# EAGLE design mouseaid (EAGLE 7.2.0)
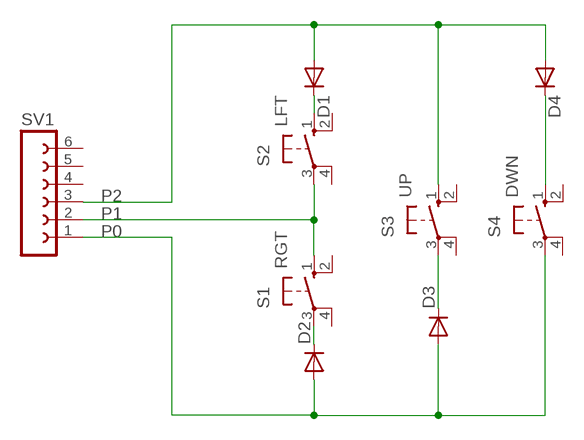
[diagram p0: schematic, sheet 1]

## Parts
D1  DIODE-D-7.5  [D-7.5]
D2  DIODE-D-7.5  [D-7.5]
D3  DIODE-D-7.5  [D-7.5]
D4  DIODE-D-7.5  [D-7.5]
S1  RGT  40-XX  [B3F-40XX]
S2  LFT  40-XX  [B3F-40XX]
S3  UP  40-XX  [B3F-40XX]
S4  DWN  40-XX  [B3F-40XX]
SV1  FE06W  [FE06W]

## Nets
N$1: D4.C S4.1(S)
N$2: D1.C S2.1(S)
N$3: D2.C S1.3(P)
N$4: D3.C S3.3(P)
P0: D2.A D3.A S4.3(P) SV1.1
P1: S1.1(S) S2.3(P) SV1.2
P2: D1.A D4.A S3.1(S) SV1.3
Unconnected: S1.2(S1) S1.4(P1) S2.2(S1) S2.4(P1) S3.2(S1) S3.4(P1) S4.2(S1) S4.4(P1) SV1.4 SV1.5 SV1.6

## Library data of the parts
D1-D4 = diode:DIODE-: DIODE
S1-S4 = switch-omron:40-XX: OMRON SWITCH; MF: OMRON COMPONENTS USA; MPN: B3F-4000; OC_FARNELL: 176434; OC_NEWARK: 36K3105
SV1 = con-lsta:FE06W: FEMALE HEADER; OC_FARNELL: unknown; OC_NEWARK: unknown

## Board
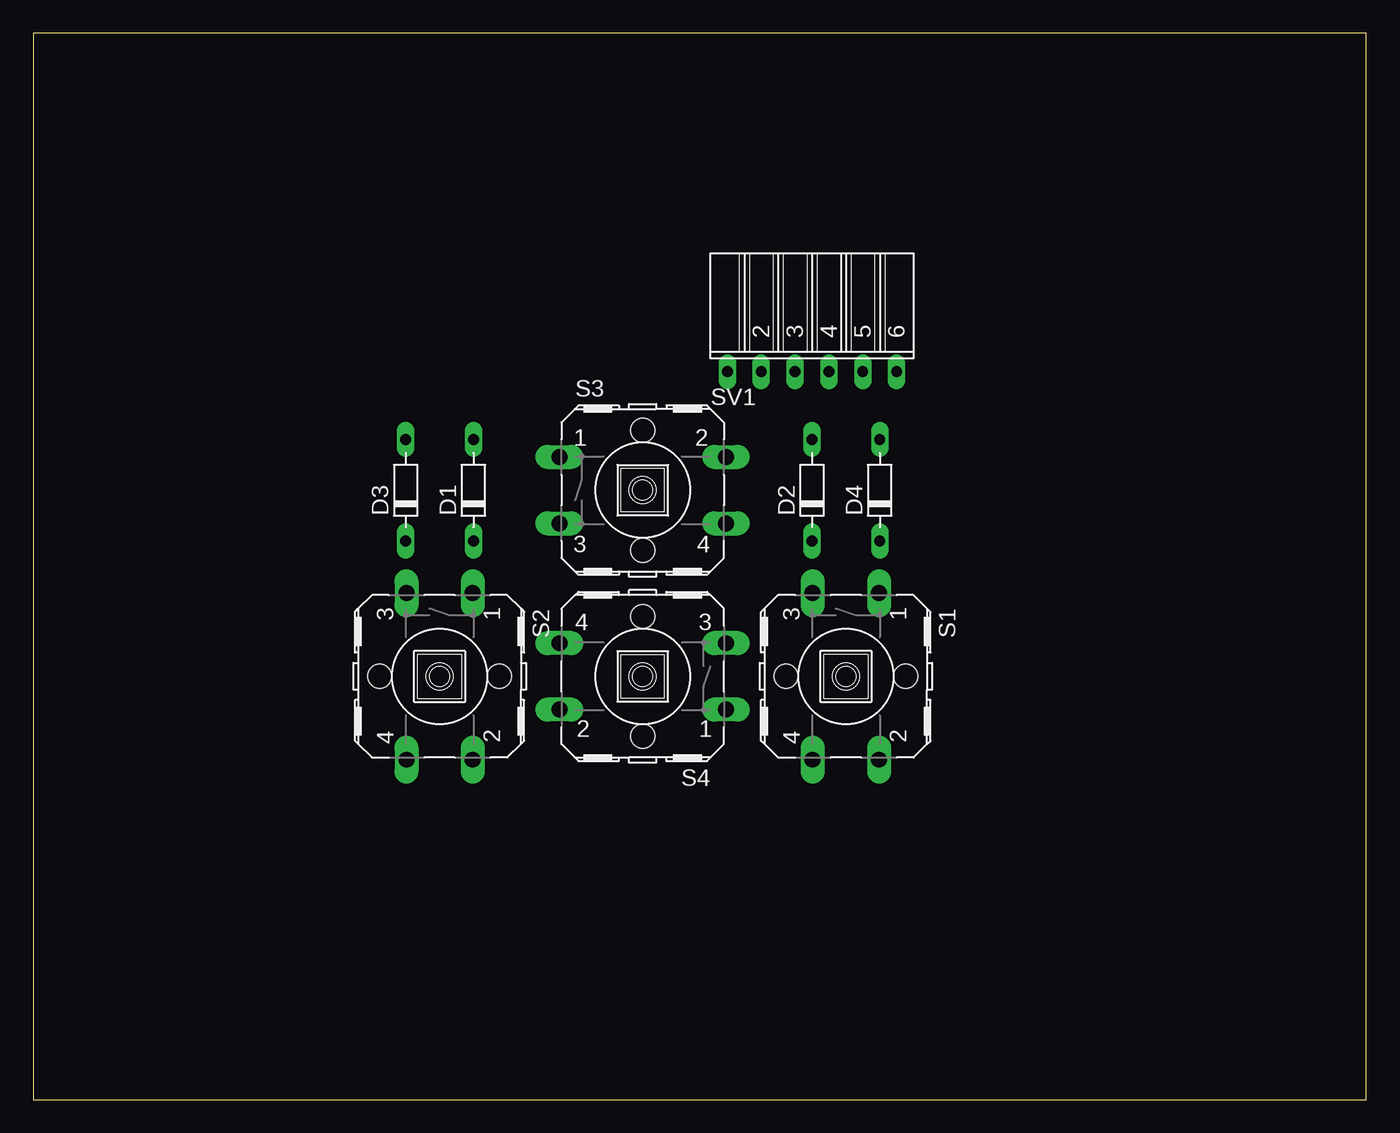
[diagram p1: board, top side]
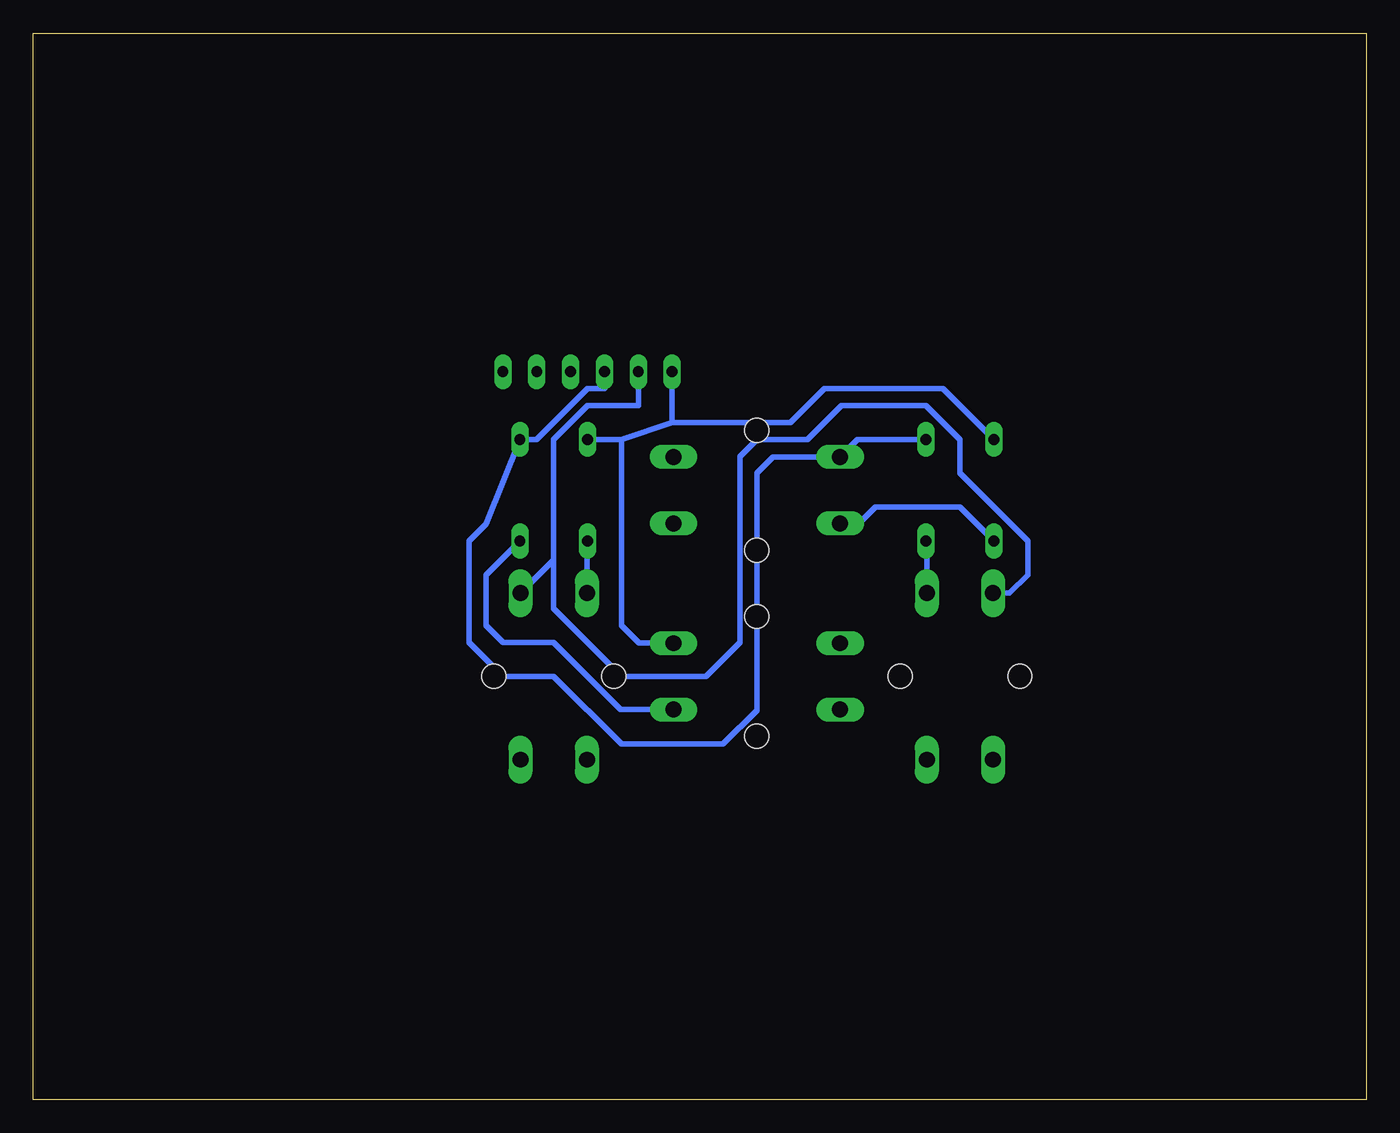
[diagram p2: board, bottom side, seen from below]

Size 100 x 80 mm. Coordinates in mm from the lower left corner, seen from the top.
Outline: 0,0 100,0 100,80 0,80 0,0
Copper layers (1*16): Top 0.035mm / dielectric 1.5mm / Bottom 0.035mm
Design rules "default": minimum track width 10mil, minimum drill 24mil, track to track 8mil, track to pad 8mil, pad to pad 8mil, via to via 8mil, smd to smd 8mil, copper to edge 40mil, drill to drill 8mil, minimum pad ring 10mil, minimum via ring 8mil, stop-mask expansion 4mil, vias tented up to drill 0mil, thermal gap 10mil

### Footprints (pad centres in the part's own frame; a part is rotated, then mirrored left to right if it is on the bottom)
D-7.5 = drill 0.813 long: A 3.81,0; C -3.81,0
B3F-40XX = drill 1.194 long: 1 -6.248,2.489; 2 6.248,2.489; 3 -6.248,-2.489; 4 6.248,-2.489 | hole 1.803: 0,-4.496; 0,4.496
FE06W = drill 0.813 long: 1 -6.35,0; 2 -3.81,0; 3 -1.27,0; 4 1.27,0; 5 3.81,0; 6 6.35,0

### Placement (x,y rotation side)
D1  33.02,45.72 90 top
D2  58.42,45.72 90 top
D3  27.94,45.72 90 top
D4  63.5,45.72 90 top
S1  60.96,31.75 270 top
S2  30.48,31.75 270 top
S3  45.72,45.72 0 top
S4  45.72,31.75 180 top
SV1  58.42,54.61 0 top

### Tracks (layer width: path | path; a pad name or v marks a point on that pad's centre or on a via)
N$1
  Bottom 0.406: D4.C 66.04,39.37 66.04,35.56 64.77,34.29 60.96,34.29 55.93,29.26 S4.1
N$2
  Bottom 0.406: S2.1 32.97,41.86 D1.C
N$3
  Bottom 0.406: D2.C 58.47,41.91 S1.3
N$4
  Bottom 0.406: S3.3 38.05,43.23 36.83,44.45 30.48,44.45 D3.C
P0
  Bottom 0.406: S4.3 54.56,34.24 55.88,35.56 55.88,49.53 | 55.88,49.53 52.07,50.8 | 52.07,50.8 SV1.1 | D2.A 55.88,49.53 | 52.07,50.8 43.18,50.8 40.64,53.34 31.75,53.34 D3.A
P1
  Bottom 0.406: S1.1 60.96,40.49 | 60.96,40.49 60.96,49.53 58.42,52.07 54.61,52.07 SV1.2 | S2.3 26.77,38 25.4,39.37 25.4,41.91 30.48,46.99 30.48,49.53 33.02,52.07 39.37,52.07 41.91,49.53 45.72,49.53 46.99,48.26 46.99,34.29 49.53,31.75 55.88,31.75 60.96,36.83 60.96,40.49
P2
  Bottom 0.406: SV1.3 57.15,53.34 58.42,53.34 62.23,49.53 D4.A 66.04,43.18 67.31,41.91 67.31,34.29 64.77,31.75 60.96,31.75 55.88,26.67 48.26,26.67 45.72,29.21 45.72,46.99 44.5,48.21 S3.1 38.15,49.53 D1.A